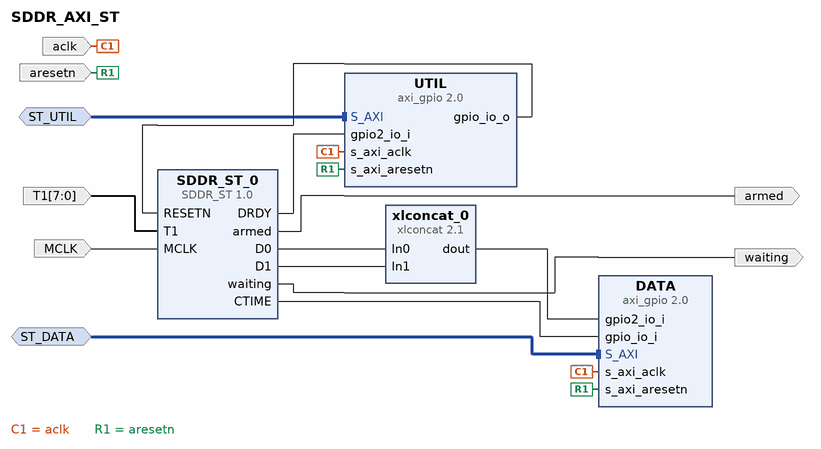
[diagram p0: block diagram of the top level]
# Vivado block design SDDR_AXI_ST, xc7z020clg400-1, Vivado 2019.1
create_bd_design SDDR_AXI_ST

create_bd_intf_port -mode Slave -vlnv xilinx.com:interface:aximm_tlm:1.0 ST_DATA
create_bd_intf_port -mode Slave -vlnv xilinx.com:interface:aximm_tlm:1.0 ST_UTIL
create_bd_port -dir I -from 7 -to 0 T1
create_bd_port -dir I -type clk MCLK
set_property -dict {CONFIG.FREQ_HZ 400000000} [get_bd_ports MCLK]
create_bd_port -dir I -type clk aclk
set_property -dict {CONFIG.FREQ_HZ 100000000} [get_bd_ports aclk]
create_bd_port -dir I -type rst aresetn
create_bd_port -dir O waiting
create_bd_port -dir O armed

create_bd_cell -type ip -vlnv xilinx.com:ip:axi_gpio:2.0 DATA
set_property -dict {CONFIG.C_ALL_INPUTS 1 CONFIG.C_ALL_INPUTS_2 1 CONFIG.C_GPIO2_WIDTH 16 CONFIG.C_IS_DUAL 1} [get_bd_cells DATA]
create_bd_cell -type ip -vlnv xilinx.com:ip:xlconcat:2.1 xlconcat_0
create_bd_cell -type ip -vlnv xilinx.com:ip:axi_gpio:2.0 UTIL
set_property -dict [list \
  CONFIG.C_ALL_INPUTS 0 \
  CONFIG.C_ALL_INPUTS_2 1 \
  CONFIG.C_ALL_OUTPUTS 1 \
  CONFIG.C_GPIO2_WIDTH 1 \
  CONFIG.C_GPIO_WIDTH 1 \
  CONFIG.C_IS_DUAL 1 \
] [get_bd_cells UTIL]
create_bd_cell -type ip -vlnv cri.nz:user:SDDR_ST:1.0 SDDR_ST_0
set_property -dict {CONFIG.SIG_WIDTH 8} [get_bd_cells SDDR_ST_0]

# ---- connections ----

connect_bd_intf_net [get_bd_intf_ports ST_DATA] [get_bd_intf_pins DATA/S_AXI]
connect_bd_intf_net [get_bd_intf_ports ST_UTIL] [get_bd_intf_pins UTIL/S_AXI]
connect_bd_net [get_bd_pins SDDR_ST_0/D0] [get_bd_pins xlconcat_0/In0]
connect_bd_net [get_bd_pins SDDR_ST_0/D1] [get_bd_pins xlconcat_0/In1]
connect_bd_net [get_bd_pins xlconcat_0/dout] [get_bd_pins DATA/gpio2_io_i]
connect_bd_net [get_bd_pins SDDR_ST_0/CTIME] [get_bd_pins DATA/gpio_io_i]
connect_bd_net [get_bd_pins UTIL/gpio_io_o] [get_bd_pins SDDR_ST_0/RESETN]
connect_bd_net [get_bd_pins SDDR_ST_0/DRDY] [get_bd_pins UTIL/gpio2_io_i]
connect_bd_net -net T1_1 [get_bd_ports T1] [get_bd_pins SDDR_ST_0/T1]
connect_bd_net [get_bd_ports MCLK] [get_bd_pins SDDR_ST_0/MCLK]
connect_bd_net [get_bd_ports aclk] [get_bd_pins UTIL/s_axi_aclk] [get_bd_pins DATA/s_axi_aclk]
connect_bd_net [get_bd_ports aresetn] [get_bd_pins DATA/s_axi_aresetn] [get_bd_pins UTIL/s_axi_aresetn]
connect_bd_net [get_bd_pins SDDR_ST_0/armed] [get_bd_ports armed]
connect_bd_net [get_bd_pins SDDR_ST_0/waiting] [get_bd_ports waiting]

validate_bd_design
save_bd_design
